# Altium schematic sheet Control Interface Board.SchDoc
size A4; Organization: TESLA Motors, INC; Address1: 3500 Deer Creek Road; Address2: Palo Alto, CA; Address4: U.S.A.; SheetNumber: 11; SheetTotal: 13
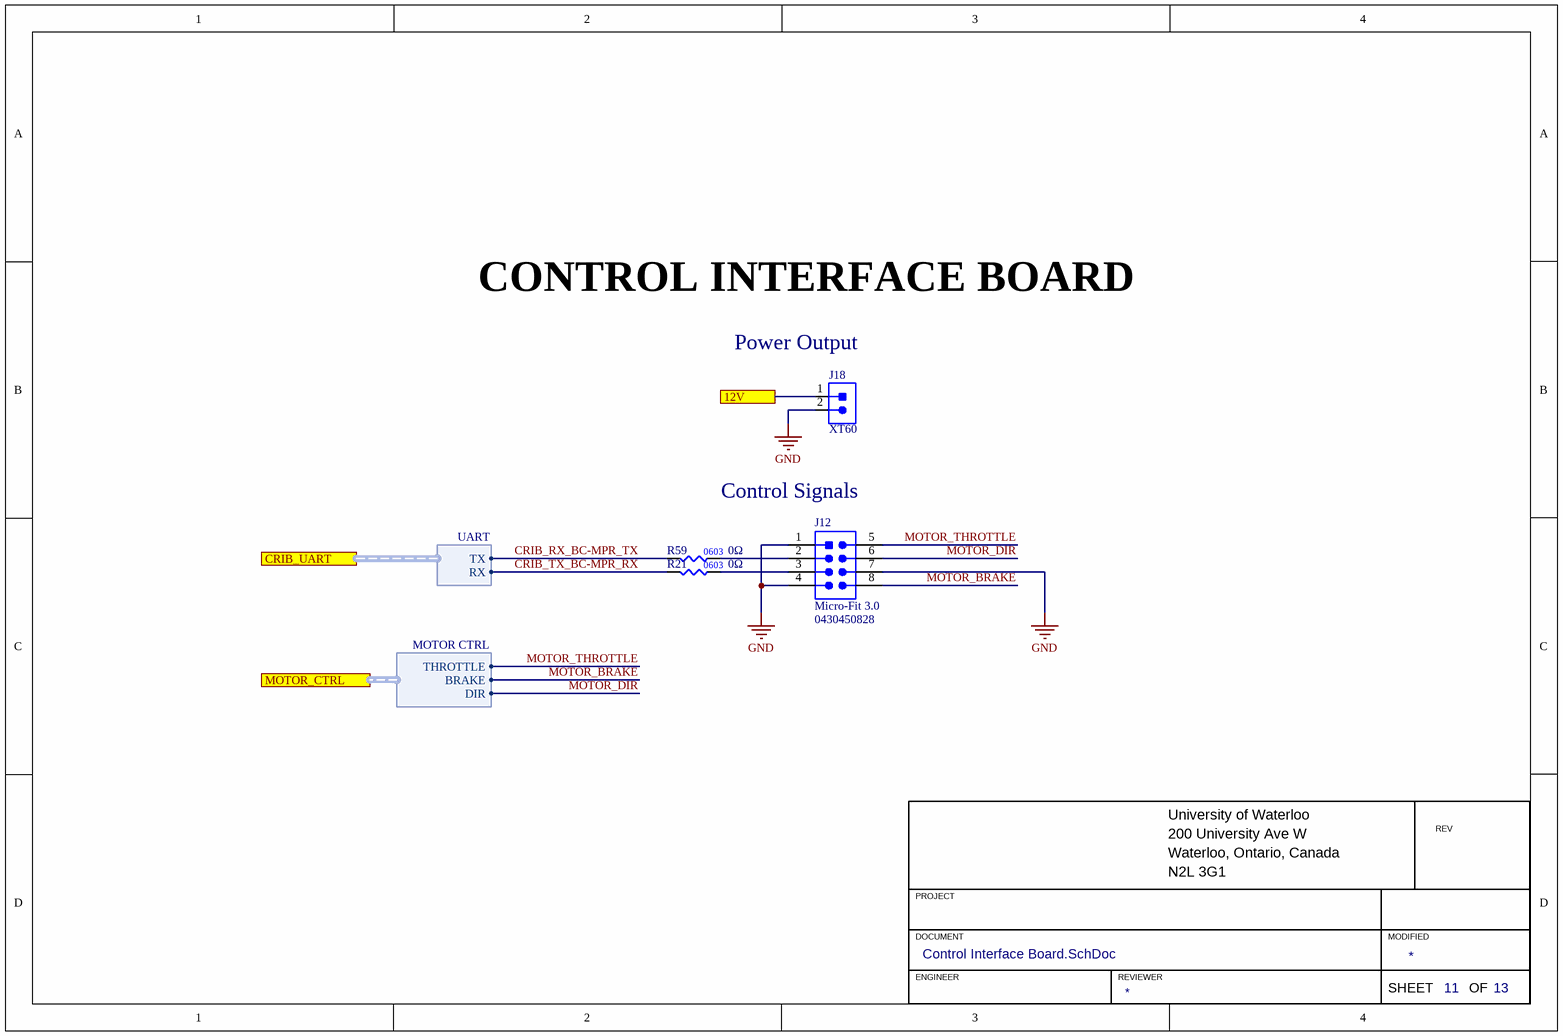
[diagram p0: Control Interface Board.SchDoc]

## Parts
J12  Family: Micro-Fit 3.0  [MOLEX-0430450828]  (hidden comment: 0430450828)
J18  CON_2POS_XT60  [XT60]  (value not drawn)
R21  value 0Ω  [RES0603]  (hidden comment: RES_0Ω_0603)
R59  value 0Ω  [RES0603]  (hidden comment: RES_0Ω_0603)

## Ports
12V, CRIB_UART (harness UART), MOTOR_CTRL (harness MOTOR CTRL)

## Harnesses
UART: TX, RX
MOTOR CTRL: THROTTLE, BRAKE, DIR

## Nets
GND: J12.1 J12.4 J12.7 J18.2
12V: J18.1 ; port 12V
CRIB_RX_BC-MPR_TX: R59.1 ; port CRIB_UART.TX
CRIB_TX_BC-MPR_RX: R21.1 ; port CRIB_UART.RX
MOTOR_BRAKE: J12.8 ; port MOTOR_CTRL.BRAKE
MOTOR_DIR: J12.6 ; port MOTOR_CTRL.DIR
MOTOR_THROTTLE: J12.5 ; port MOTOR_CTRL.THROTTLE
NetJ12_2: J12.2 R59.2
NetJ12_3: J12.3 R21.2

## Notes on the sheet
- CONTROL INTERFACE BOARD
- (near J18) Power Output
- Control Signals
- University of Waterloo
- 200 University Ave W
- REV
- PROJECT
- Waterloo, Ontario, Canada
- N2L 3G1
- DOCUMENT
- ENGINEER
- REVIEWER
- MODIFIED
- SHEET
- OF

## Library data of the parts
J12 = CON_MOLEX-HDR_4x2_TH: CONN HEADER VERT 8POS 3MM; Manufacturer 1: Molex; Voltage Rating: 250VAC; Current Rating: 5A; Pitch: 3mm; Supplier 1: Digi-Key; Supplier Part Number 1: WM10693-ND; Manufacturer Part Number 1: 0430450828
J18 = CON_2POS_XT60: XT60 CONNECTORS MALE/FEMALE PAIR; Manufacturer 1: SparkFun Electronics; Manufacturer Part Number 1: PRT-10474; Mounting Type: TH; Package/Footprint: XT60; Supplier 1: Digi-Key; Supplier Part Number 1: 1568-1816-ND
R21 R59 = RES_0Ω_0603: RES 0 OHM JUMPER 1/10W 0603; Manufacturer 1: Yageo; Manufacturer Part Number 1: RC0603JR-070RL; Supplier Part Number 1: 311-0.0GRCT-ND; Supplier 1: Digi-Key; Mounting Type: SMD; Package: 0603